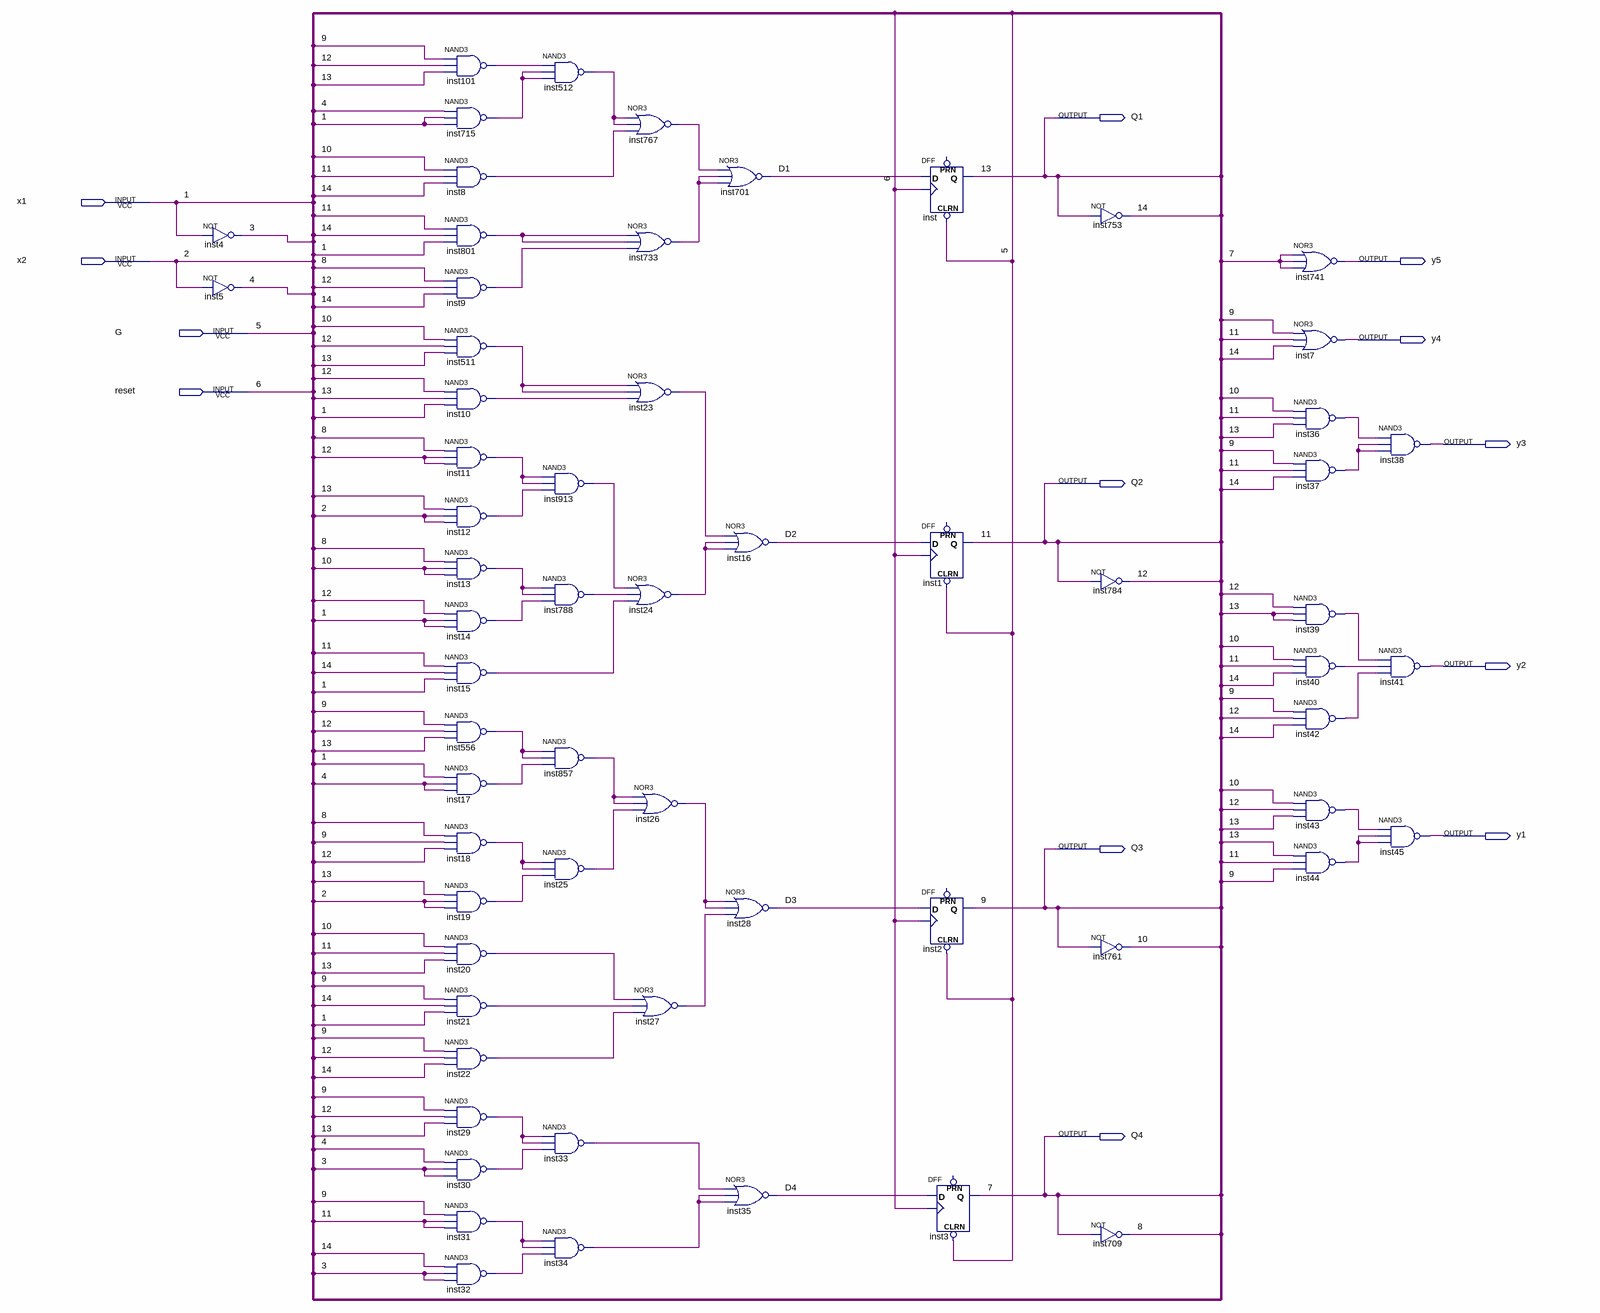
[diagram p0: schematic sheet]
// Quartus schematic DMKR.bdf as structural Verilog: 62 symbols, 13 pins
module DMKR (
  input  x1,
  input  x2,
  input  G,
  input  reset,
  output Q1,
  output y5,
  output y4,
  output y3,
  output Q2,
  output y2,
  output y1,
  output Q3,
  output Q4
);

  wire \3 , \4 , \8 , \10 , \12 , \14 , D1, D2, D3, D4, inst8_out, inst9_out, inst10_out, inst11_out,
       inst12_out, inst13_out, inst14_out, inst15_out, inst17_out, inst18_out, inst19_out, inst20_out,
       inst21_out, inst22_out, inst23_out, inst24_out, inst25_out, inst26_out, inst27_out, inst29_out,
       inst30_out, inst31_out, inst32_out, inst33_out, inst34_out, inst36_out, inst37_out, inst39_out,
       inst40_out, inst42_out, inst43_out, inst44_out, inst101_out, inst511_out, inst512_out, inst556_out,
       inst715_out, inst733_out, inst767_out, inst788_out, inst801_out, inst857_out, inst913_out;

  not inst4 (\3 , x1);
  not inst5 (\4 , x2);
  nand inst101 (inst101_out, Q3, \12 , Q1);
  nand inst715 (inst715_out, \4 , x1, x1);
  nand inst8 (inst8_out, \10 , Q2, \14 );
  nand inst801 (inst801_out, Q2, \14 , x1);
  nand inst9 (inst9_out, \8 , \12 , \14 );
  nand inst511 (inst511_out, \10 , \12 , Q1);
  nand inst10 (inst10_out, \12 , Q1, x1);
  nand inst11 (inst11_out, \8 , \12 , \12 );
  nand inst12 (inst12_out, Q1, x2, x2);
  nand inst13 (inst13_out, \8 , \10 , \10 );
  nand inst14 (inst14_out, \12 , x1, x1);
  nand inst15 (inst15_out, Q2, \14 , x1);
  nand inst556 (inst556_out, Q3, \12 , Q1);
  nand inst17 (inst17_out, x1, \4 , \4 );
  nand inst18 (inst18_out, \8 , Q3, \12 );
  nand inst19 (inst19_out, Q1, x2, x2);
  nand inst20 (inst20_out, \10 , Q2, Q1);
  nand inst21 (inst21_out, Q3, \14 , x1);
  nand inst22 (inst22_out, Q3, \12 , \14 );
  nand inst29 (inst29_out, Q3, \12 , Q1);
  nand inst30 (inst30_out, \4 , \3 , \3 );
  nand inst31 (inst31_out, Q3, Q2, Q2);
  nand inst32 (inst32_out, \14 , \3 , \3 );
  nand inst512 (inst512_out, inst101_out, inst715_out, inst715_out);
  nand inst913 (inst913_out, inst11_out, inst11_out, inst12_out);
  nand inst788 (inst788_out, inst13_out, inst13_out, inst14_out);
  nand inst857 (inst857_out, inst556_out, inst556_out, inst17_out);
  nand inst25 (inst25_out, inst18_out, inst18_out, inst19_out);
  nand inst33 (inst33_out, inst29_out, inst29_out, inst30_out);
  nand inst34 (inst34_out, inst31_out, inst31_out, inst32_out);
  nor inst767 (inst767_out, inst512_out, inst512_out, inst8_out);
  nor inst733 (inst733_out, inst801_out, inst801_out, inst9_out);
  nor inst23 (inst23_out, inst511_out, inst511_out, inst10_out);
  nor inst24 (inst24_out, inst913_out, inst788_out, inst15_out);
  nor inst26 (inst26_out, inst857_out, inst857_out, inst25_out);
  nor inst27 (inst27_out, inst20_out, inst21_out, inst22_out);
  nor inst701 (D1, inst767_out, inst733_out, inst733_out);
  nor inst16 (D2, inst23_out, inst24_out, inst24_out);
  nor inst28 (D3, inst26_out, inst26_out, inst27_out);
  nor inst35 (D4, inst33_out, inst34_out, inst34_out);
  DFF inst (.CLRN(G), .CLK(reset), .D(D1), .Q(Q1));  // open: PRN
  DFF inst1 (.CLRN(G), .CLK(reset), .D(D2), .Q(Q2));  // open: PRN
  DFF inst2 (.CLRN(G), .CLK(reset), .D(D3), .Q(Q3));  // open: PRN
  DFF inst3 (.CLRN(G), .CLK(reset), .D(D4), .Q(Q4));  // open: PRN
  not inst753 (\14 , Q1);
  not inst784 (\12 , Q2);
  not inst761 (\10 , Q3);
  not inst709 (\8 , Q4);
  nor inst741 (y5, Q4, Q4, Q4);
  nor inst7 (y4, Q3, Q2, \14 );
  nand inst36 (inst36_out, \10 , Q2, Q1);
  nand inst37 (inst37_out, Q3, Q2, \14 );
  nand inst39 (inst39_out, \12 , Q1, Q1);
  nand inst40 (inst40_out, \10 , Q2, \14 );
  nand inst42 (inst42_out, Q3, \12 , \14 );
  nand inst43 (inst43_out, \10 , \12 , Q1);
  nand inst44 (inst44_out, Q1, Q2, Q3);
  nand inst38 (y3, inst36_out, inst37_out, inst37_out);
  nand inst41 (y2, inst39_out, inst40_out, inst42_out);
  nand inst45 (y1, inst43_out, inst44_out, inst44_out);

  // Other names for the same wires on the sheet: 5 = G; 6 = reset; 7 = Q4; 9 = Q3; 11 = Q2; 13 = Q1; 1 = x1; 2 = x2
endmodule
